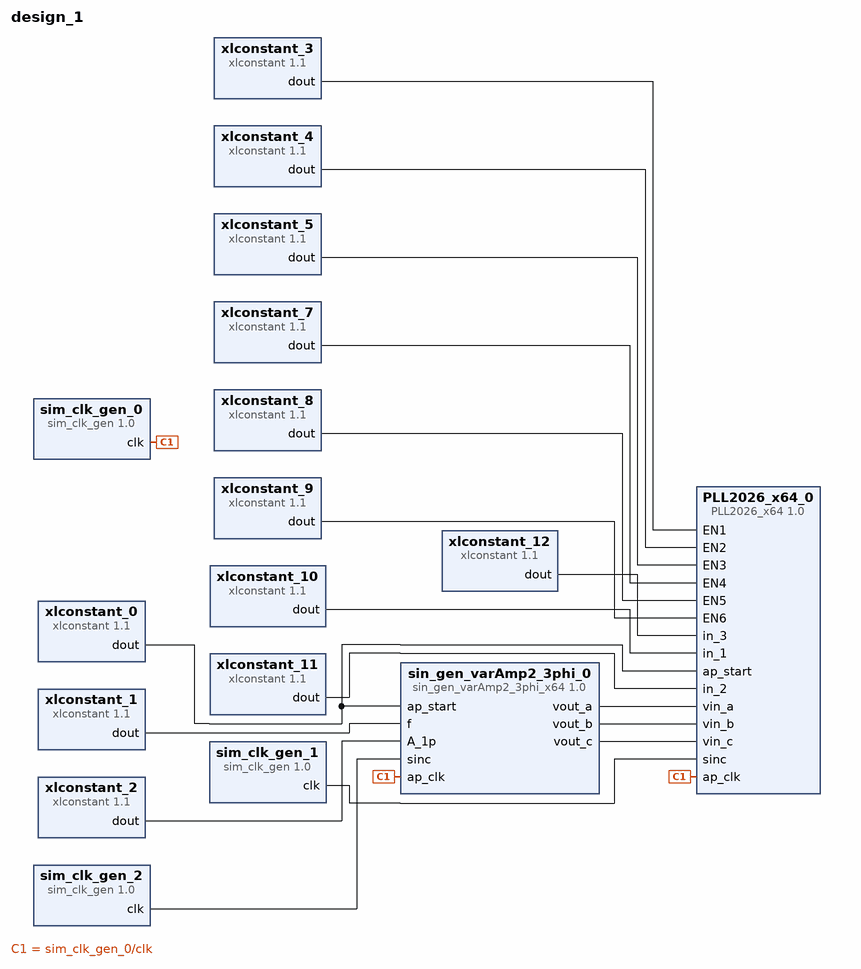
[diagram p0: block diagram of the top level]
# Vivado block design design_1, xc7a200tfbg676-2, Vivado 2020.2
create_bd_design design_1

create_bd_cell -type ip -vlnv xilinx.com:user:sin_gen_varAmp2_3phi_x64:1.0 sin_gen_varAmp2_3phi_0
create_bd_cell -type ip -vlnv xilinx.com:ip:sim_clk_gen:1.0 sim_clk_gen_0
create_bd_cell -type ip -vlnv xilinx.com:ip:sim_clk_gen:1.0 sim_clk_gen_1
set_property -dict {CONFIG.FREQ_HZ 250000} [get_bd_cells sim_clk_gen_1]
create_bd_cell -type ip -vlnv xilinx.com:ip:xlconstant:1.1 xlconstant_0
create_bd_cell -type ip -vlnv xilinx.com:ip:xlconstant:1.1 xlconstant_1
set_property -dict {CONFIG.CONST_VAL 0x3c000000000000 CONFIG.CONST_WIDTH 64} [get_bd_cells xlconstant_1]
create_bd_cell -type ip -vlnv xilinx.com:ip:xlconstant:1.1 xlconstant_2
set_property -dict {CONFIG.CONST_VAL 0x1e000000000000 CONFIG.CONST_WIDTH 64} [get_bd_cells xlconstant_2]
create_bd_cell -type ip -vlnv xilinx.com:ip:xlconstant:1.1 xlconstant_3
set_property -dict {CONFIG.CONST_VAL 1} [get_bd_cells xlconstant_3]
create_bd_cell -type ip -vlnv xilinx.com:ip:xlconstant:1.1 xlconstant_4
set_property -dict {CONFIG.CONST_VAL 1} [get_bd_cells xlconstant_4]
create_bd_cell -type ip -vlnv xilinx.com:ip:xlconstant:1.1 xlconstant_5
set_property -dict {CONFIG.CONST_VAL 1} [get_bd_cells xlconstant_5]
create_bd_cell -type ip -vlnv xilinx.com:ip:xlconstant:1.1 xlconstant_7
set_property -dict {CONFIG.CONST_VAL 0} [get_bd_cells xlconstant_7]
create_bd_cell -type ip -vlnv xilinx.com:ip:xlconstant:1.1 xlconstant_8
set_property -dict {CONFIG.CONST_VAL 0} [get_bd_cells xlconstant_8]
create_bd_cell -type ip -vlnv xilinx.com:ip:xlconstant:1.1 xlconstant_9
set_property -dict {CONFIG.CONST_VAL 0} [get_bd_cells xlconstant_9]
create_bd_cell -type ip -vlnv xilinx.com:ip:xlconstant:1.1 xlconstant_10
set_property -dict {CONFIG.CONST_VAL 0x19000000000000 CONFIG.CONST_WIDTH 64} [get_bd_cells xlconstant_10]
create_bd_cell -type ip -vlnv xilinx.com:ip:xlconstant:1.1 xlconstant_11
set_property -dict {CONFIG.CONST_VAL 0x4000000000000 CONFIG.CONST_WIDTH 64} [get_bd_cells xlconstant_11]
create_bd_cell -type ip -vlnv xilinx.com:ip:xlconstant:1.1 xlconstant_12
set_property -dict {CONFIG.CONST_VAL 0x40000000000000 CONFIG.CONST_WIDTH 64} [get_bd_cells xlconstant_12]
create_bd_cell -type ip -vlnv xilinx.com:ip:sim_clk_gen:1.0 sim_clk_gen_2
set_property -dict {CONFIG.FREQ_HZ 1000000} [get_bd_cells sim_clk_gen_2]
create_bd_cell -type ip -vlnv xilinx.com:user:PLL2026_x64:1.0 PLL2026_x64_0

# ---- connections ----

connect_bd_net [get_bd_pins sim_clk_gen_0/clk] [get_bd_pins sin_gen_varAmp2_3phi_0/ap_clk] [get_bd_pins PLL2026_x64_0/ap_clk]
connect_bd_net [get_bd_pins xlconstant_0/dout] [get_bd_pins sin_gen_varAmp2_3phi_0/ap_start] [get_bd_pins PLL2026_x64_0/ap_start]
connect_bd_net [get_bd_pins xlconstant_1/dout] [get_bd_pins sin_gen_varAmp2_3phi_0/f]
connect_bd_net [get_bd_pins xlconstant_2/dout] [get_bd_pins sin_gen_varAmp2_3phi_0/A_1p]
connect_bd_net [get_bd_pins sin_gen_varAmp2_3phi_0/vout_a] [get_bd_pins PLL2026_x64_0/vin_a]
connect_bd_net [get_bd_pins sin_gen_varAmp2_3phi_0/vout_b] [get_bd_pins PLL2026_x64_0/vin_b]
connect_bd_net [get_bd_pins sin_gen_varAmp2_3phi_0/vout_c] [get_bd_pins PLL2026_x64_0/vin_c]
connect_bd_net [get_bd_pins xlconstant_3/dout] [get_bd_pins PLL2026_x64_0/EN1]
connect_bd_net [get_bd_pins xlconstant_4/dout] [get_bd_pins PLL2026_x64_0/EN2]
connect_bd_net [get_bd_pins xlconstant_5/dout] [get_bd_pins PLL2026_x64_0/EN3]
connect_bd_net [get_bd_pins xlconstant_7/dout] [get_bd_pins PLL2026_x64_0/EN4]
connect_bd_net [get_bd_pins xlconstant_8/dout] [get_bd_pins PLL2026_x64_0/EN5]
connect_bd_net [get_bd_pins xlconstant_9/dout] [get_bd_pins PLL2026_x64_0/EN6]
connect_bd_net [get_bd_pins xlconstant_10/dout] [get_bd_pins PLL2026_x64_0/in_1]
connect_bd_net [get_bd_pins xlconstant_11/dout] [get_bd_pins PLL2026_x64_0/in_2]
connect_bd_net [get_bd_pins xlconstant_12/dout] [get_bd_pins PLL2026_x64_0/in_3]
connect_bd_net [get_bd_pins sim_clk_gen_1/clk] [get_bd_pins PLL2026_x64_0/sinc]
connect_bd_net [get_bd_pins sim_clk_gen_2/clk] [get_bd_pins sin_gen_varAmp2_3phi_0/sinc]

validate_bd_design
save_bd_design
